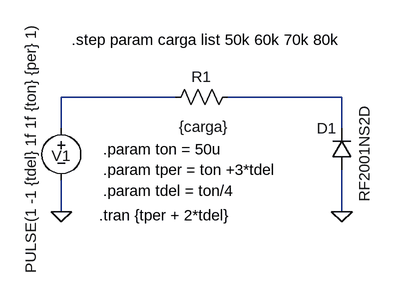
[diagram p0: schematic Draft2.asc]
Draft2.asc, the LTspice schematic file:
Version 4
SHEET 1 880 680
WIRE 256 96 80 96
WIRE 512 96 336 96
WIRE 80 144 80 96
WIRE 512 144 512 96
WIRE 80 272 80 224
WIRE 512 272 512 208
FLAG 80 272 0
FLAG 512 272 0
SYMBOL voltage 80 128 R0
WINDOW 0 -15 58 Left 2
WINDOW 3 -47 239 VLeft 2
WINDOW 123 0 0 Left 2
WINDOW 39 0 0 Left 2
SYMATTR InstName V1
SYMATTR Value PULSE(1 -1 {tdel} 1f 1f {ton} {per} 1)
SYMBOL res 352 80 R90
WINDOW 0 0 56 VBottom 2
WINDOW 3 46 52 VTop 2
SYMATTR InstName R1
SYMATTR Value {carga}
SYMBOL diode 528 208 R180
WINDOW 0 24 64 Left 2
WINDOW 3 -19 101 VLeft 2
SYMATTR InstName D1
SYMATTR Value RF2001NS2D
TEXT 144 176 Left 2 !.param ton = 50u
TEXT 144 208 Left 2 !.param tper = ton +3*tdel
TEXT 144 240 Left 2 !.param tdel = ton/4
TEXT 96 8 Left 2 !.step param carga list 50k 60k 70k 80k
TEXT 138 278 Left 2 !.tran {tper + 2*tdel}

The netlist it stands for:
* Draft2.asc
V1 N001 0 PULSE(1 -1 {tdel} 1f 1f {ton} {per} 1)
R1 N002 N001 {carga}
D1 0 N002 RF2001NS2D
.model D D
.lib standard.dio
.param ton = 50u
.param tper = ton +3*tdel
.param tdel = ton/4
.step param carga list 50k 60k 70k 80k
.tran {tper + 2*tdel}
.backanno
.end